# EAGLE design wireless-sensor-node (EAGLE 7.6.0)
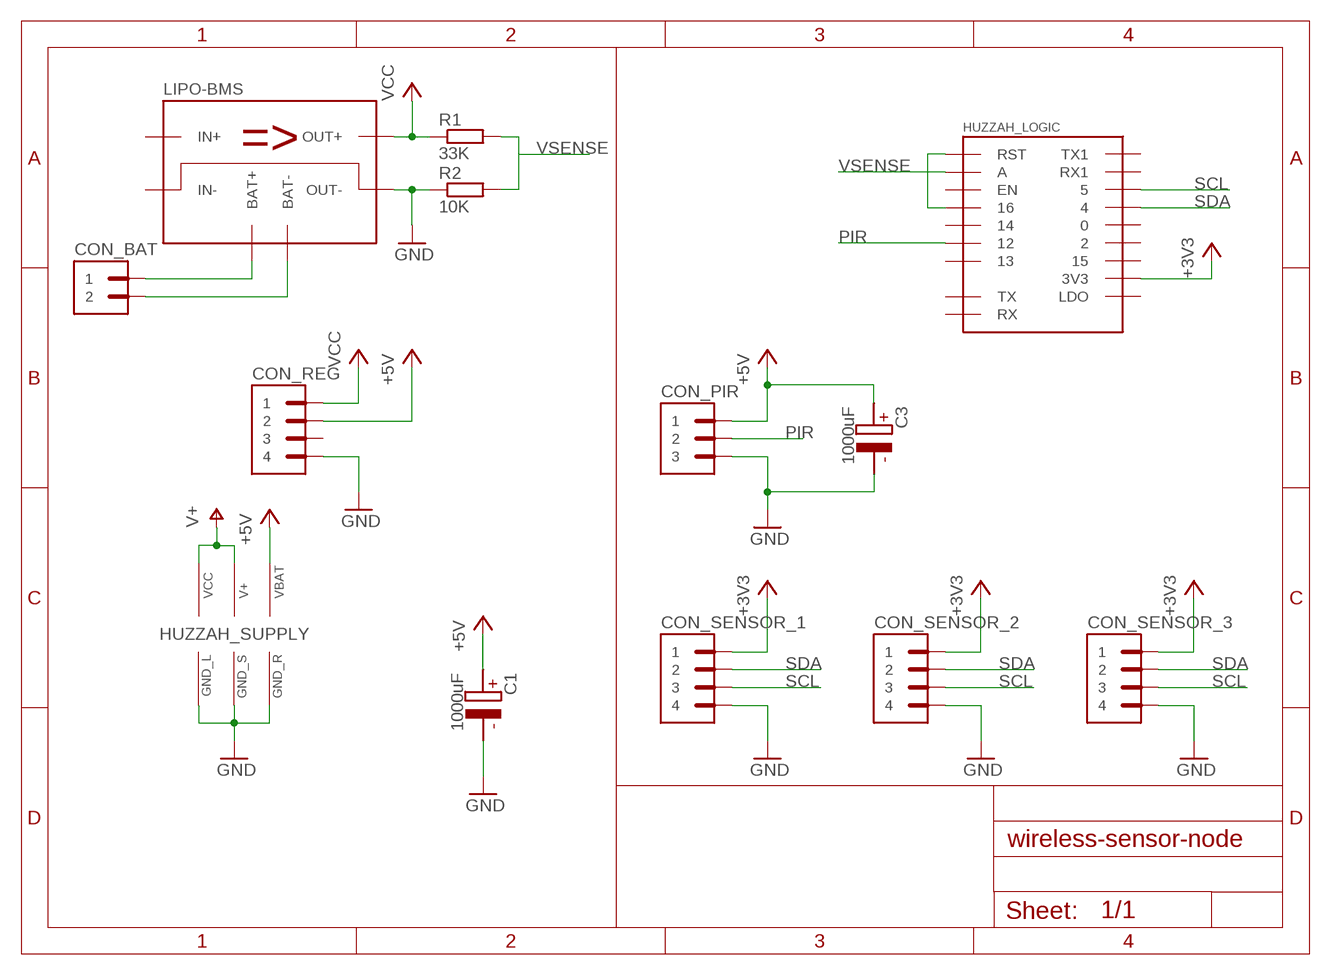
[diagram p0: schematic, sheet 1]

## Parts
C1  1000uF  CAPACITOR_POLARIZED-10X13-5.0  [CAP_POL_10X13_5]
C3  1000uF  CAPACITOR_POLARIZED-10X13-5.0  [CAP_POL_10X13_5]
CON_BAT  PIN_HEADER_2-WIDE  [BREAKAWAY_STRAIGHT_2_WIDE]
CON_PIR  PIN_HEADER_3-WIDE  [BREAKAWAY_STRAIGHT_3_WIDE]
CON_REG  PIN_HEADER_4-WIDE  [BREAKAWAY_STRAIGHT_4_WIDE]
CON_SENSOR_1  PIN_HEADER_4-WIDE  [BREAKAWAY_STRAIGHT_4_WIDE]
CON_SENSOR_2  PIN_HEADER_4-WIDE  [BREAKAWAY_STRAIGHT_4_WIDE]
CON_SENSOR_3  PIN_HEADER_4-WIDE  [BREAKAWAY_STRAIGHT_4_WIDE]
HUZZAH  ADAFRUIT_HUZZAH-THT-NM  [ADAFRUIT_HUZZAH_NO_MOUNTS]
LIPO-BMS  LIPO-BMS-CHARGER-MODULE  [LIPO-BMS-CHARGER]
R1  33K  RESISTOR-1/4W-12.7-AXIAL  [RESISTOR-1/4W-AXIAL]
R2  10K  RESISTOR-1/4W-12.7-AXIAL  [RESISTOR-1/4W-AXIAL]

## Nets
+3V3: CON_SENSOR_1.1 CON_SENSOR_2.1 CON_SENSOR_3.1 HUZZAH.3.3V(_LOGIC:3V3)
+5V: C1.A C3.A CON_PIR.1 CON_REG.2 HUZZAH.VBAT(_SUPPLY:VBAT)
BAT+: CON_BAT.1 LIPO-BMS.BAT+
BAT-: CON_BAT.2 LIPO-BMS.BAT-
GND: C1.C C3.C CON_PIR.3 CON_REG.4 CON_SENSOR_1.4 CON_SENSOR_2.4 CON_SENSOR_3.4 HUZZAH.GND_L(_SUPPLY:GND_L) HUZZAH.GND_R(_SUPPLY:GND_R) HUZZAH.GND_S(_SUPPLY:GND_S) LIPO-BMS.OUT- R2.P$1
N$1: HUZZAH.16 HUZZAH.RST(_LOGIC:RST)
PIR: CON_PIR.2 HUZZAH.12
SCL: CON_SENSOR_1.3 CON_SENSOR_2.3 CON_SENSOR_3.3 HUZZAH.5
SDA: CON_SENSOR_1.2 CON_SENSOR_2.2 CON_SENSOR_3.2 HUZZAH.4
V+: HUZZAH.V+(_SUPPLY:V+) HUZZAH.VCC(_SUPPLY:VCC)
VCC: CON_REG.1 LIPO-BMS.OUT+ R1.P$1
VSENSE: HUZZAH.A(_LOGIC:A) R1.P$2 R2.P$2
Unconnected: CON_REG.3 HUZZAH.0 HUZZAH.2 HUZZAH.13 HUZZAH.14 HUZZAH.15 HUZZAH.EN(_LOGIC:EN) HUZZAH.LDO(_LOGIC:LDO) HUZZAH.RX(_LOGIC:RX) HUZZAH.RX_1(_LOGIC:RX1) HUZZAH.TX(_LOGIC:TX) HUZZAH.TX_1(_LOGIC:TX1)

## Power pins joined to a net without a drawn wire
IN+: LIPO-BMS.IN+
IN-: LIPO-BMS.IN-

## Library data of the parts
C1 C3 = icmi-passive-parts:CAPACITOR_POLARIZED: Polarized capacitor, e.g. electrolytic capacitor
CON_BAT = icmi-connectors:PIN_HEADER_2
CON_PIR = icmi-connectors:PIN_HEADER_3
CON_REG CON_SENSOR_1-CON_SENSOR_3 = icmi-connectors:PIN_HEADER_4
HUZZAH = icmi-custom-parts:ADAFRUIT_HUZZAH: Adafruit HUZZAH ESP8266 breakout This is the device for the ESP8266 breakout board from Adafruit, called the Huzzah. Refer to https://learn.adafruit.com/adafruit-huzzah-esp8266-breakout for more information.
LIPO-BMS = icmi-custom-parts:LIPO-BMS-CHARGER: LIPO BMS/charger for single cells This is the symbol for a combined LiPo charger / protection circuit, usually found on ebay. These modules use a TP4056 for charging and a DW01 for cell protection. Please note that IN- and OUT- are connected to each other, whereas all other pins are are seperate. The module also features a Micro-USB connector, not represented in the package here.
R1 R2 = icmi-passive-parts:RESISTOR-1/4W

## Board
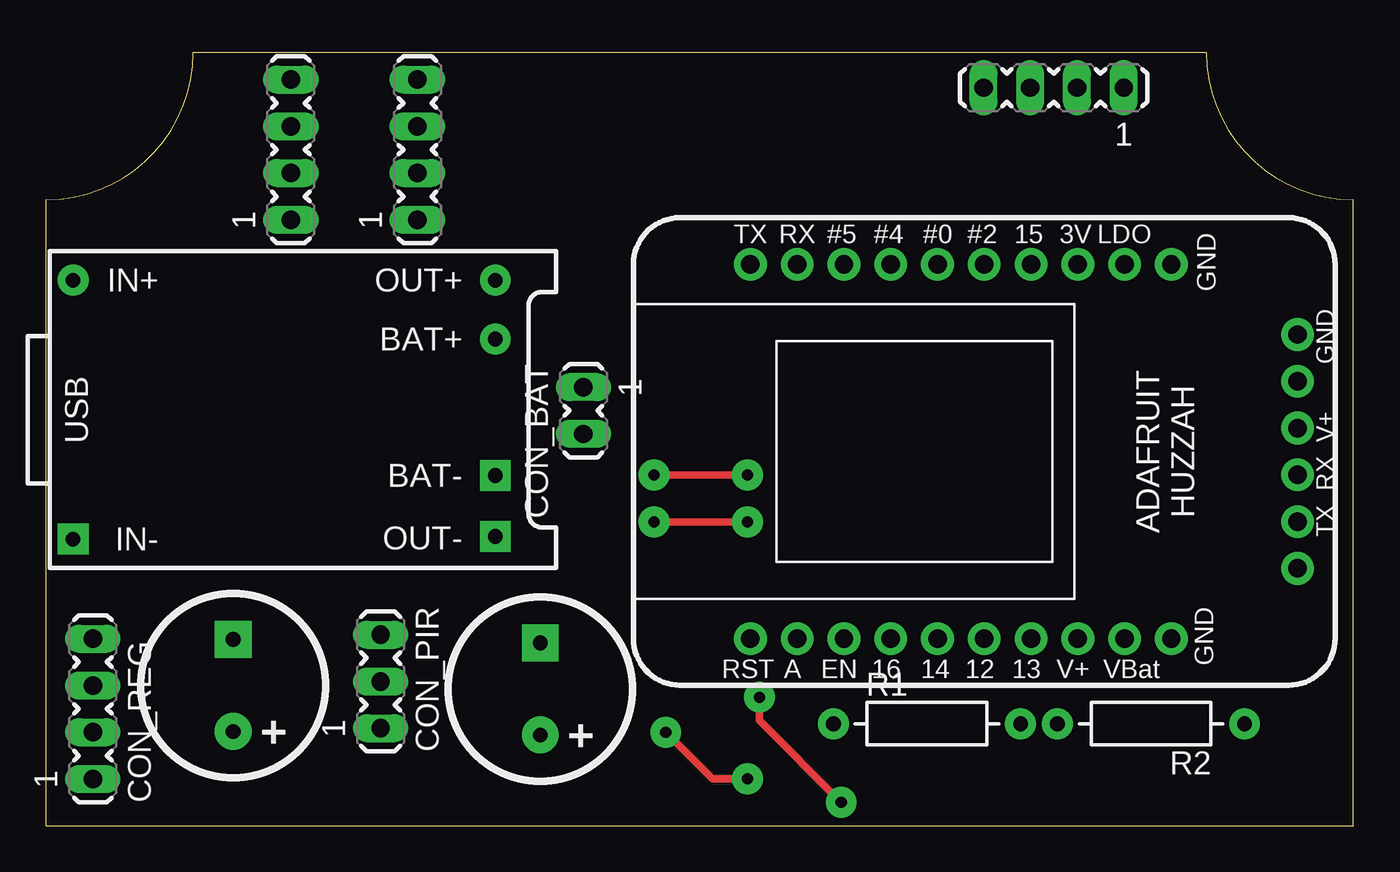
[diagram p1: board, top side]
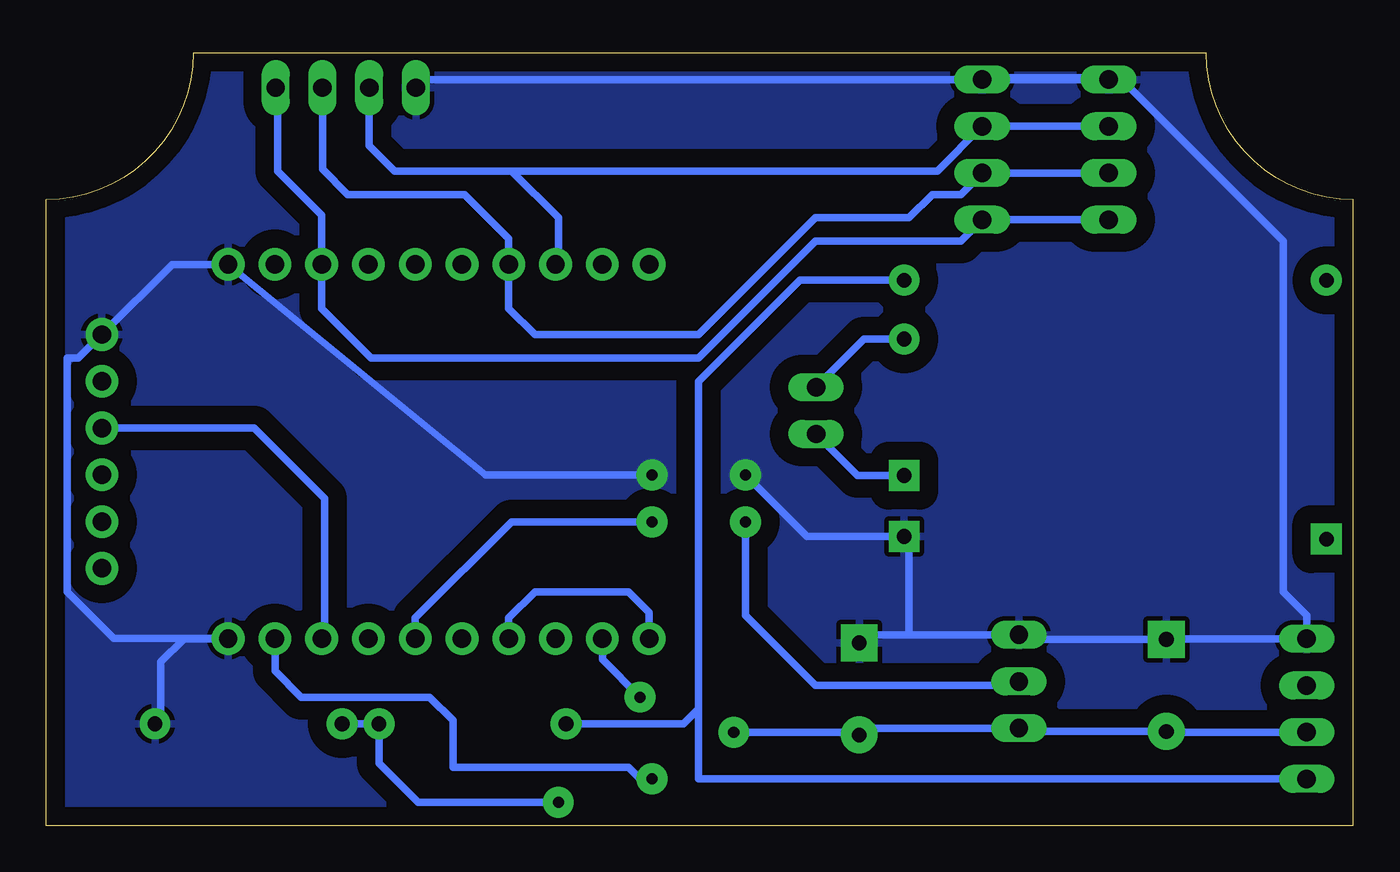
[diagram p2: board, bottom side, seen from below]

Size 71 x 42 mm. Coordinates in mm from the lower left corner, seen from the top.
Outline: 0,0 0,34 arc90 8,42 63,42 arc90 71,34 71,0 0,0
Copper layers (1*16): Top 0.035mm / dielectric 1.5mm / Bottom 0.035mm
Design rules "default": minimum track width 10mil, minimum drill 24mil, track to track 8mil, track to pad 8mil, pad to pad 8mil, via to via 8mil, smd to smd 8mil, copper to edge 40mil, drill to drill 8mil, minimum pad ring 10mil, minimum via ring 8mil, stop-mask expansion 4mil, vias tented up to drill 0mil, thermal gap 10mil

### Footprints (pad centres in the part's own frame; a part is rotated, then mirrored left to right if it is on the bottom)
CAP_POL_10X13_5 = drill 0.8 pad 2: A 2.5,0 | drill 0.8 pad 2 square: C -2.5,0
BREAKAWAY_STRAIGHT_2_WIDE = drill 1 long: 1 0,-1.27; 2 0,1.27
BREAKAWAY_STRAIGHT_3_WIDE = drill 1 long: 1 0,-2.54; 2 0,0; 3 0,2.54
BREAKAWAY_STRAIGHT_4_WIDE = drill 1 long: 1 0,-3.81; 2 0,-1.27; 3 0,1.27; 4 0,3.81
ADAFRUIT_HUZZAH_NO_MOUNTS = drill 1 pad 1.778: 0 22.86,21.59; 2 22.86,19.05; 3.3V 22.86,13.97; 4 22.86,24.13; 5 22.86,26.67; 12 2.54,19.05; 13 2.54,16.51; 14 2.54,21.59; 15 22.86,16.51; 16 2.54,24.13; A 2.54,29.21; EN 2.54,26.67; GND_L 2.54,8.89; GND_R 22.86,8.89; GND_S 19.05,2.032; LDO 22.86,11.43; NC1 6.35,2.032; NC2 16.51,2.032; RST 2.54,31.75; RX 11.43,2.032; RX_1 22.86,29.21; TX 8.89,2.032; TX_1 22.86,31.75; V+ 2.54,13.97; VBAT 2.54,11.43; VCC 13.97,2.032
LIPO-BMS-CHARGER = drill 0.8 pad 1.676: BAT+ 12.43,3.3; IN+ 15.63,26.23; OUT+ 15.63,3.3 | drill 0.8 pad 1.676 square: BAT- 5.02,3.3; IN- 1.57,26.23; OUT- 1.72,3.3
RESISTOR-1/4W-AXIAL = drill 0.8 pad 1.676: P$1 -5.08,0; P$2 5.08,0

### Placement (x,y rotation side)
C1  26.84,7.43 270 top
C3  10.16,7.62 270 top
CON_BAT  29.18,22.55 180 top
CON_PIR  18.17,7.84 0 top
CON_REG  2.54,6.35 0 top
CON_SENSOR_1  13.29,36.72 0 top
CON_SENSOR_2  20.17,36.72 0 top
CON_SENSOR_3  54.72,40.09 90 top
HUZZAH  70,7.63 90 top
LIPO-BMS  27.7,14 90 top
R1  47.84,5.54 0 top
R2  60.01,5.54 180 top

### Tracks (layer width: path | path; a pad name or v marks a point on that pad's centre or on a via)
+3V3
  Bottom 0.406: CON_SENSOR_1.1 CON_SENSOR_2.1 | CON_SENSOR_2.1 20.21,32.91 20.32,33.02 20.28,33.02 CON_SENSOR_2.1 | CON_SENSOR_3.1 58.42,39.98 58.42,35.56 56.03,33.17 HUZZAH.3.3V 56.03,28.09 53.34,25.4 35.56,25.4 29.21,31.75 21.33,31.75 CON_SENSOR_2.1
+5V  (via drill 0.6 pad 1.68)
  Top 0.406: v33.66,5.08 36.2,2.54 v38.1,2.54
  Bottom 0.406: CON_REG.2 10.16,5.08 C3.A 18.17,5.12 CON_PIR.1 26.84,5.3 C1.A 26.99,5.08 v33.66,5.08 | HUZZAH.VBAT 58.57,8.4 57.15,6.99 50.16,6.99 48.9,5.71 48.9,3.17 39.37,3.17 38.73,2.54 v38.1,2.54
BAT+
  Bottom 0.406: LIPO-BMS.BAT+ 26.57,26.43 CON_BAT.1
BAT-
  Bottom 0.406: LIPO-BMS.BAT- 26.93,19.02 CON_BAT.2
GND  (via drill 0.6 pad 1.68)
  Top 0.406: v38.1,19.05 v33.02,19.05
  Bottom 0.406: 24.13,10.38 CON_PIR.3 18.17,10.12 C3.C 10.16,10.16 CON_REG.4 2.54,11.43 3.81,12.7 3.81,31.75 12.7,40.64 20.06,40.64 CON_SENSOR_2.4 | C1.C 26.84,10.38 24.13,10.38 | CON_SENSOR_1.4 CON_SENSOR_2.4 | CON_SENSOR_2.4 50.47,40.53 CON_SENSOR_3.4 | 24.13,10.38 24.13,15.72 LIPO-BMS.OUT- 29.69,15.72 v33.02,19.05 | v38.1,19.05 47.13,19.05 HUZZAH.GND_R 64.16,30.49 HUZZAH.GND_S 69.25,25.4 69.85,25.4 69.85,12.7 67.32,10.17 HUZZAH.GND_L 63.5,10.16 64.77,8.89 64.77,5.86 R2.P$1
  pour Bottom (isolate 1): 0,0 0,34.29 0.64,34.29 arc90 8.26,41.91 62.87,41.91 arc90 71.12,33.66 71.12,0
N$1
  Bottom 0.406: HUZZAH.RST 38.25,11.58 39.37,12.7 44.45,12.7 45.87,11.28 HUZZAH.16
PIR  (via drill 0.6 pad 1.68)
  Top 0.406: v33.02,16.51 v38.1,16.51
  Bottom 0.406: CON_PIR.2 18.39,7.62 29.21,7.62 33.02,11.43 v33.02,16.51 | v38.1,16.51 45.72,16.51 50.95,11.28 HUZZAH.12
SCL
  Bottom 0.406: CON_SENSOR_1.3 CON_SENSOR_2.3 22.6,35.56 45.72,35.56 | HUZZAH.5 43.18,30.64 43.18,33.02 45.72,35.56 | 45.72,35.56 52.07,35.56 53.45,36.94 CON_SENSOR_3.3
SDA
  Bottom 0.406: CON_SENSOR_1.2 CON_SENSOR_2.2 21.33,34.29 22.86,34.29 24.13,33.02 29.21,33.02 35.56,26.67 44.45,26.67 45.87,28.09 HUZZAH.4 45.87,31.9 48.26,34.29 54.61,34.29 55.99,35.67 CON_SENSOR_3.2
V+
  Bottom 0.406: HUZZAH.VCC 59.7,21.6 55.88,17.78 55.88,10.32 HUZZAH.V+
VCC
  Bottom 0.406: LIPO-BMS.OUT+ 30.06,29.63 35.56,24.13 35.56,6.35 | 35.56,6.35 35.56,2.54 CON_REG.1 | R1.P$1 36.37,5.54 35.56,6.35
VSENSE  (via drill 0.6 pad 1.68)
  Top 0.406: v38.73,6.99 38.73,5.71 v43.18,1.27
  Bottom 0.406: R2.P$2 R1.P$2 52.92,3.39 50.8,1.27 v43.18,1.27 | HUZZAH.A 40.79,9.04 v38.73,6.99